# Altium project Keypad 4x4.PrjPcb
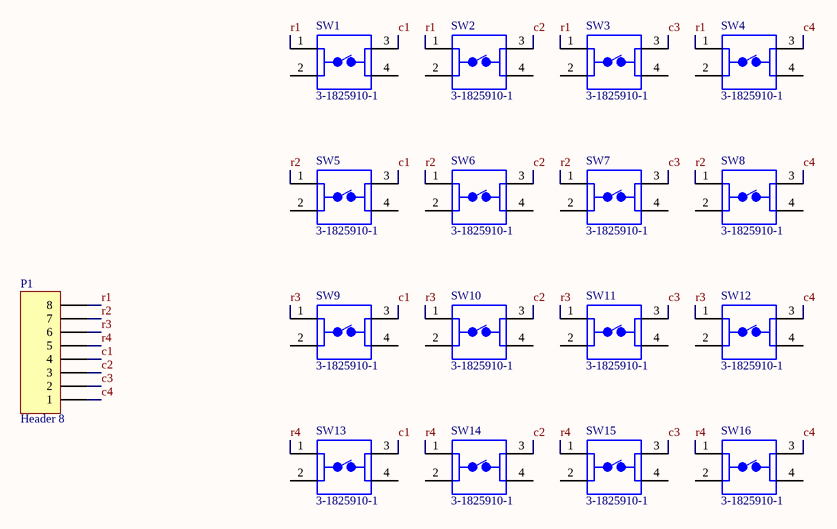
[diagram p0: Sheet1.SchDoc]
1 sheet, 17 parts. Net scope: global (net labels, ports and power ports of the same name join across sheets).
Board file: PCB1.PcbDoc

## Sheet Sheet1.SchDoc
size A; SheetNumber: 1; SheetTotal: 1

### Parts
P1  Header 8  [HDR1X8]
SW1  3-1825910-1  [TE_3-1825910-1]
SW2  3-1825910-1  [TE_3-1825910-1]
SW3  3-1825910-1  [TE_3-1825910-1]
SW4  3-1825910-1  [TE_3-1825910-1]
SW5  3-1825910-1  [TE_3-1825910-1]
SW6  3-1825910-1  [TE_3-1825910-1]
SW7  3-1825910-1  [TE_3-1825910-1]
SW8  3-1825910-1  [TE_3-1825910-1]
SW9  3-1825910-1  [TE_3-1825910-1]
SW10  3-1825910-1  [TE_3-1825910-1]
SW11  3-1825910-1  [TE_3-1825910-1]
SW12  3-1825910-1  [TE_3-1825910-1]
SW13  3-1825910-1  [TE_3-1825910-1]
SW14  3-1825910-1  [TE_3-1825910-1]
SW15  3-1825910-1  [TE_3-1825910-1]
SW16  3-1825910-1  [TE_3-1825910-1]

### Nets
c1: P1.4 SW1.3 SW5.3 SW9.3 SW13.3
c2: P1.3 SW2.3 SW6.3 SW10.3 SW14.3
c3: P1.2 SW3.3 SW7.3 SW11.3 SW15.3
c4: P1.1 SW4.3 SW8.3 SW12.3 SW16.3
r1: P1.8 SW1.1 SW2.1 SW3.1 SW4.1
r2: P1.7 SW5.1 SW6.1 SW7.1 SW8.1
r3: P1.6 SW9.1 SW10.1 SW11.1 SW12.1
r4: P1.5 SW13.1 SW14.1 SW15.1 SW16.1

Not connected (* = marked no-connect by the designer): SW1 2 4; SW2 2 4; SW3 2 4; SW4 2 4; SW5 2 4; SW6 2 4; SW7 2 4; SW8 2 4; SW9 2 4; SW10 2 4; SW11 2 4; SW12 2 4; SW13 2 4; SW14 2 4; SW15 2 4; SW16 2 4

### Library data of the parts
P1 = Header 8: Header, 8-Pin; LatestRevisionDate: 17-Jul-2002; LatestRevisionNote: Re-released for DXP Platform.; Publisher: Altium Limited
SW1-SW16 = 3-1825910-1: Switch Push Button OFF _ON_ SPST Round Button 0.05A 24VDC Momentary Contact PC Pins Thru-Hole; MF: TE Connectivity; Availability: Unavailable; SnapEDA_Link: https://www.snapeda.com/parts/3-1825910-1/TE%20Connectivity%20ALCOSWITCH%20Switches/view-part/452461/?ref=snap; Price: None; EU_RoHS_Compliance: Compliant; Package: None; TE_purchase_URL: https://www.te.com/usa-en/product-3-1825910-1.html?te_bu=Cor&te_type=disp&te_campaign=seda_glo_cor-seda-global-disp-prtnr-fy19-seda-model-bom-cta_sma-317_1&elqCampaignId=32493; MP: 3-1825910-1; Value: *